# EAGLE design WarpverterSimulator_201904_01 (EAGLE 6.1)
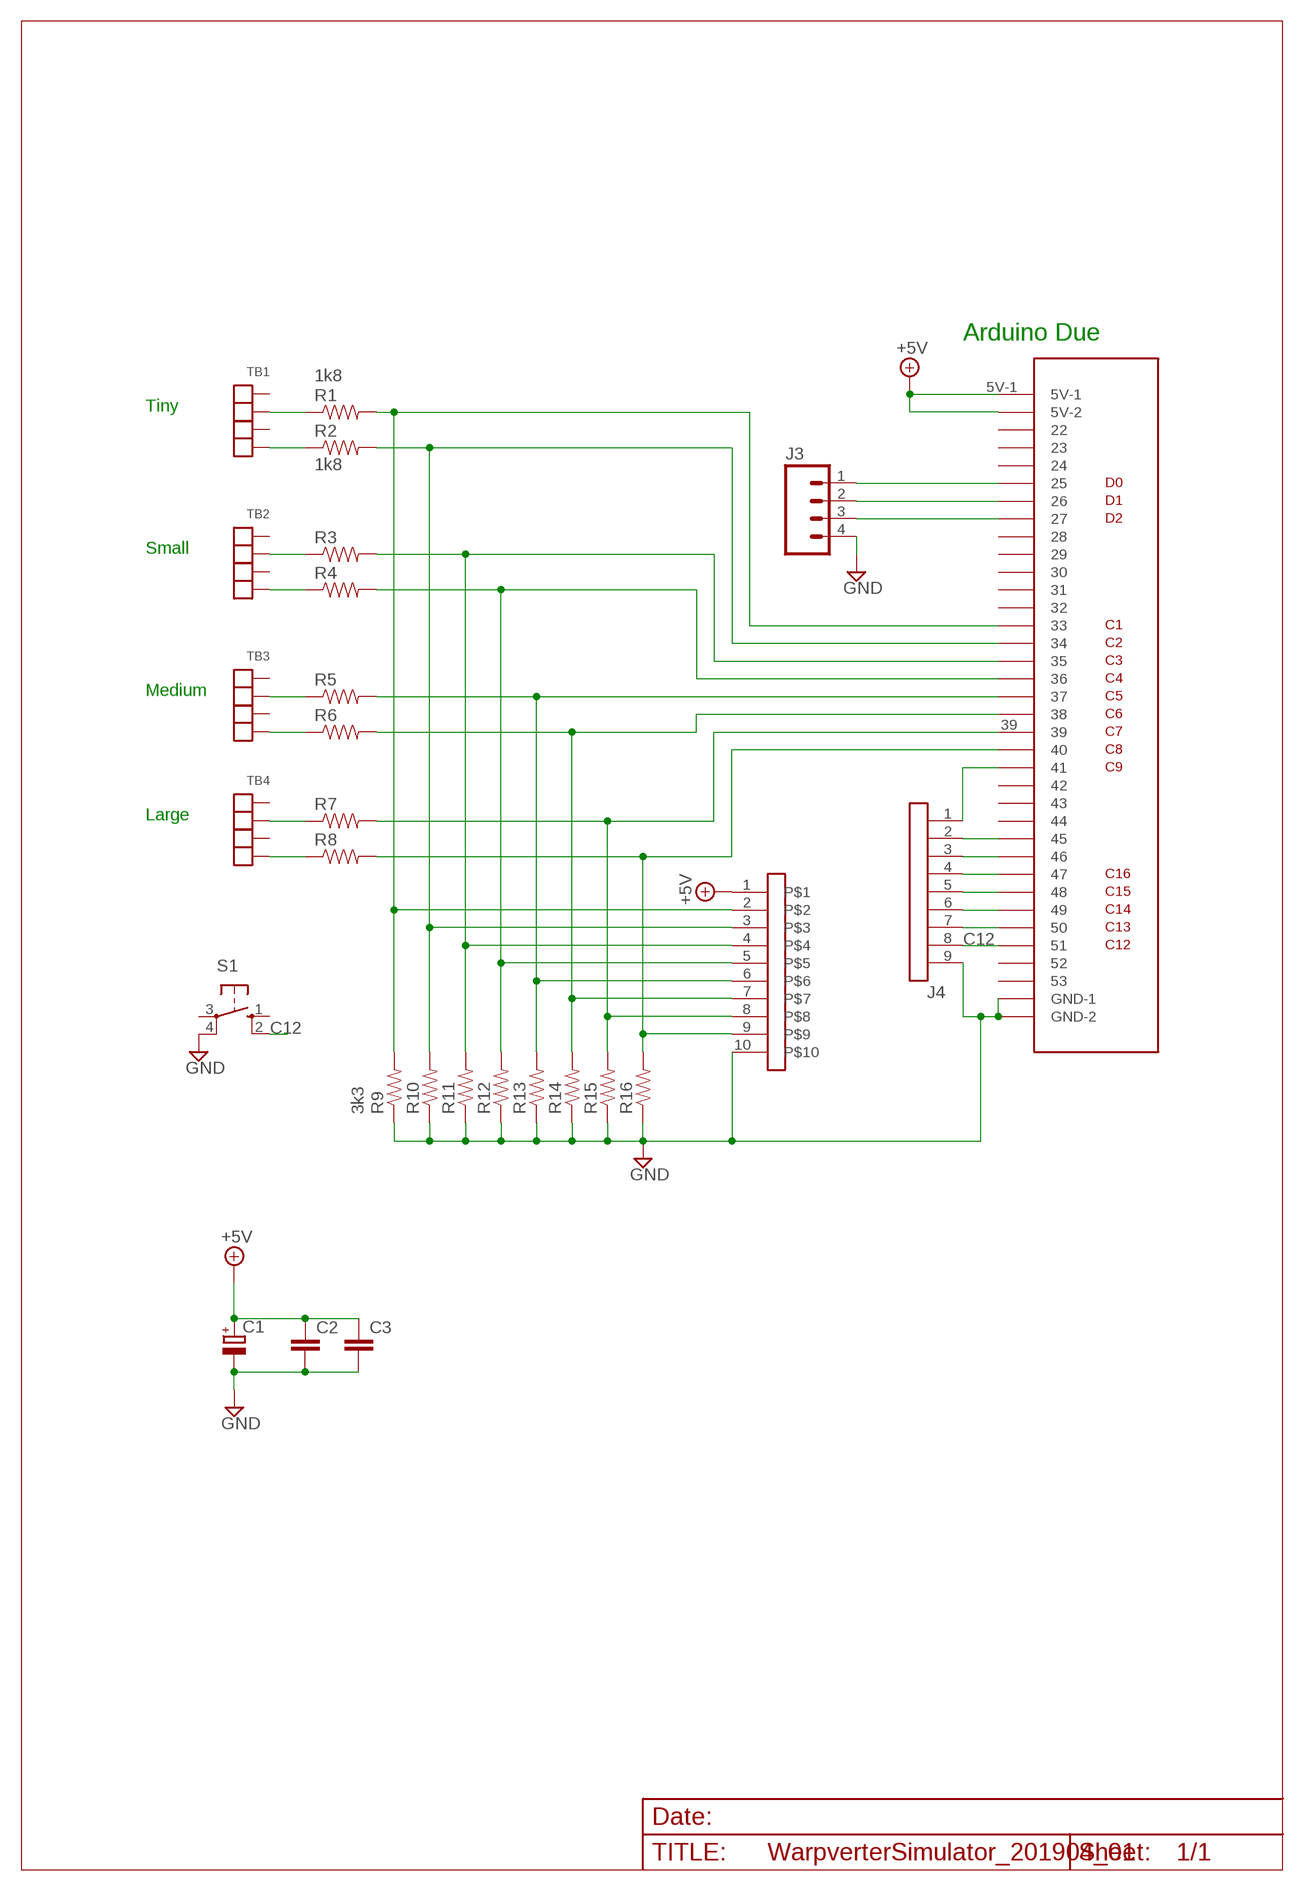
[diagram p0: schematic, sheet 1]

## Parts
C1  C-RB200100  [CPOL-RADIAL-10UF-25V]
C2  BCAP  [BCAP]
C3  BCAP  [BCAP]
J1  DUE-IDC38  [DUE-IDC38]
J2  SIL-STACK-10  [SIL-STACK-10]
J3  SIL4  [SIL4]
J4  SIL-9  [SIL-9]
R1  1k8  R4  [AXIAL-0.4]
R2  1k8  R4  [AXIAL-0.4]
R3  R4  [AXIAL-0.4]
R4  R4  [AXIAL-0.4]
R5  R4  [AXIAL-0.4]
R6  R4  [AXIAL-0.4]
R7  R4  [AXIAL-0.4]
R8  R4  [AXIAL-0.4]
R9  3k3  R4  [AXIAL-0.4]
R10  R4  [AXIAL-0.4]
R11  R4  [AXIAL-0.4]
R12  R4  [AXIAL-0.4]
R13  R4  [AXIAL-0.4]
R14  R4  [AXIAL-0.4]
R15  R4  [AXIAL-0.4]
R16  R4  [AXIAL-0.4]
S1  10-XX  [B3F-10XX]
TB1  TB4381_SIL  [TB-381-SIL-4P]
TB2  TB4381_SIL  [TB-381-SIL-4P]
TB3  TB4381_SIL  [TB-381-SIL-4P]
TB4  TB4381_SIL  [TB-381-SIL-4P]

## Nets
+5V: C1.1(+) C2.1 C3.1 J1.5V-1 J1.5V-2 J2.1
C12: J1.51 J4.8 S1.2(S1)
GND: C1.2(-) C2.2 C3.2 J1.GND-1 J1.GND-2 J2.10 J3.4 J4.9 R9.P$1 R10.P$1 R11.P$1 R12.P$1 R13.P$1 R14.P$1 R15.P$1 R16.P$1 S1.4(P1)
N$1: R1.P$1 TB1.2 TB1.12
N$2: R2.P$1 TB1.4 TB1.14
N$3: R3.P$1 TB2.2 TB2.12
N$4: R4.P$1 TB2.4 TB2.14
N$5: R5.P$1 TB3.2 TB3.12
N$6: R6.P$1 TB3.4 TB3.14
N$7: R7.P$1 TB4.2 TB4.12
N$8: R8.P$1 TB4.4 TB4.14
N$9: J1.33 J2.2 R1.P$2 R9.P$2
N$10: J1.34 J2.3 R2.P$2 R10.P$2
N$11: J1.35 J2.4 R3.P$2 R11.P$2
N$12: J1.36 J2.5 R4.P$2 R12.P$2
N$13: J1.37 J2.6 R5.P$2 R13.P$2
N$14: J1.38 J2.7 R6.P$2 R14.P$2
N$15: J1.39 J2.8 R7.P$2 R15.P$2
N$16: J1.40 J2.9 R8.P$2 R16.P$2
N$18: J1.25 J3.1
N$19: J1.26 J3.2
N$20: J1.27 J3.3
N$24: J1.50 J4.7
N$25: J1.49 J4.6
N$26: J1.48 J4.5
N$27: J1.47 J4.4
N$28: J1.46 J4.3
N$29: J1.45 J4.2
N$30: J1.41 J4.1
Unconnected: J1.22 J1.23 J1.24 J1.28 J1.29 J1.30 J1.31 J1.32 J1.42 J1.43 J1.44 J1.52 J1.53 S1.1(S) S1.3(P) TB1.1 TB1.3 TB1.11 TB1.13 TB2.1 TB2.3 TB2.11 TB2.13 TB3.1 TB3.3 TB3.11 TB3.13 TB4.1 TB4.3 TB4.11 TB4.13

## Notes on the sheet
- Arduino Due
- Tiny
- Small
- Medium
- Large

## Library data of the parts
C1 = Andrew:C-RB200100
C2 C3 = Andrew Misc:BCAP
J1 = Andrew_Arduino:DUE-IDC38
J2 = Andrew_Connectors:SIL-STACK-10
J3 = Andrew_Connectors:SIL4
J4 = Andrew_Connectors:SIL-9
R1-R16 = Andrew Misc:R4
S1 = switch-omron:10-XX: OMRON SWITCH; MPN: B3F-1000; OC_FARNELL: 176432; OC_NEWARK: 36M3542
TB1-TB4 = Andrew_Connectors:TB4

## Board
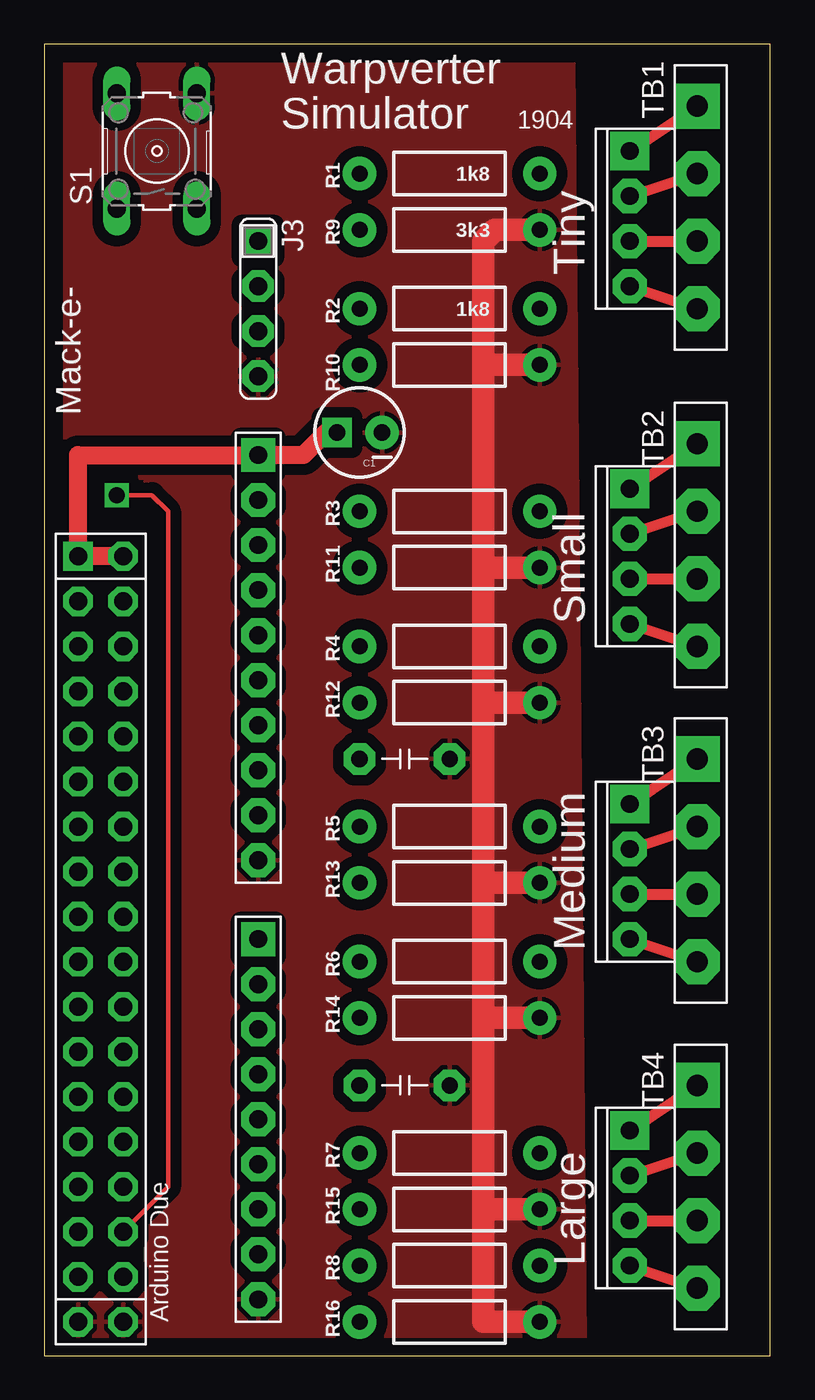
[diagram p1: board, top side]
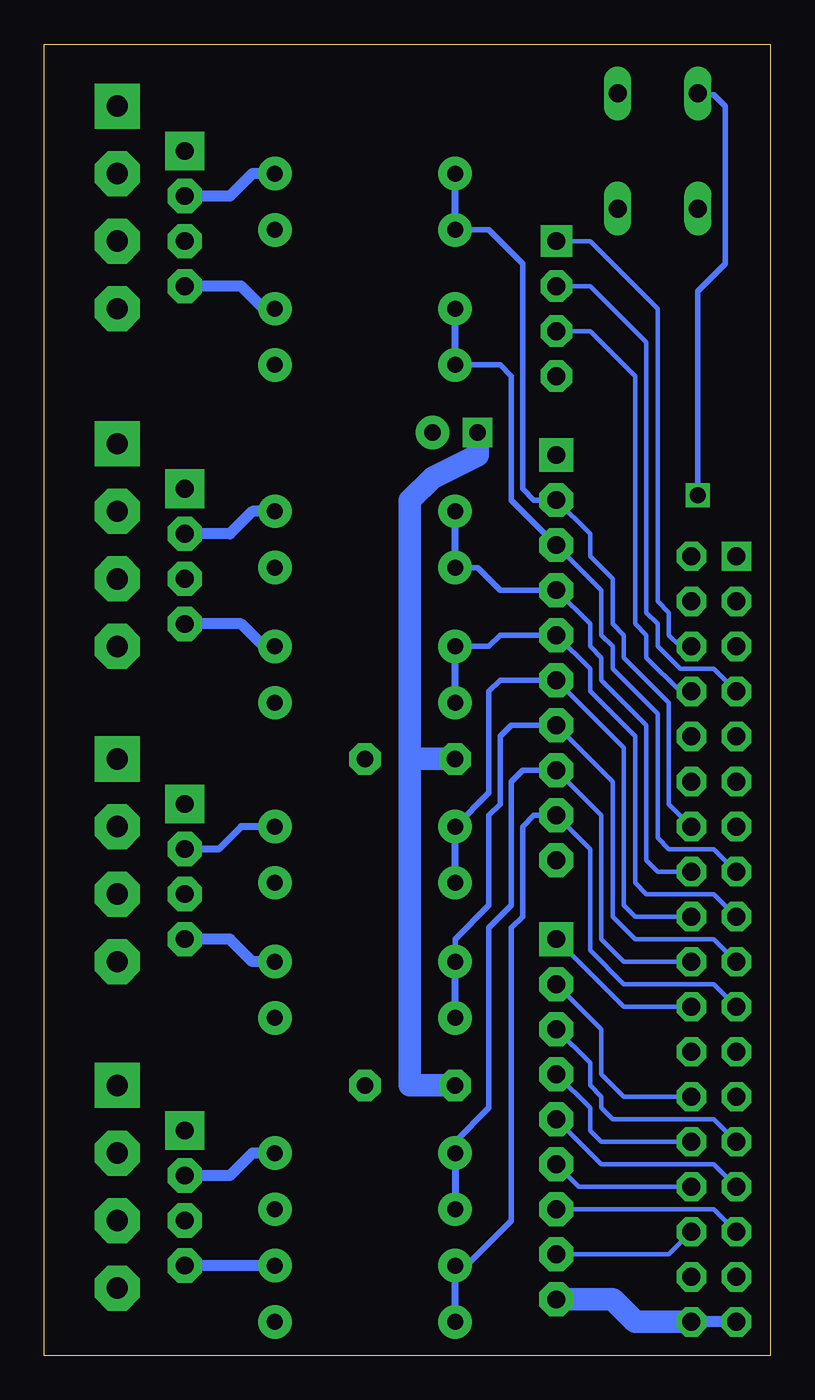
[diagram p2: board, bottom side, seen from below]

Size 40.95 x 73.97 mm. Coordinates in mm from the lower left corner, seen from the top.
Outline: 0,0 40.95,0 40.95,73.97 0,73.97 0,0
Copper layers (1*16): Top 0.035mm / dielectric 1.5mm / Bottom 0.035mm
Design rules: minimum track width 10mil, minimum drill 24mil, track to track 8mil, track to pad 8mil, pad to pad 8mil, via to via 8mil, smd to smd 8mil, copper to edge 40mil, drill to drill 8mil, minimum pad ring 10mil, minimum via ring 8mil, stop-mask expansion 4mil, vias tented up to drill 0mil, thermal gap 10mil

### Footprints (pad centres in the part's own frame; a part is rotated, then mirrored left to right if it is on the bottom)
CPOL-RADIAL-10UF-25V = drill 0.914 pad 1.651 square: 1 1.27,0 | drill 0.914 pad 1.905: 2 -1.27,0
BCAP = drill 0.914 pad 1.778 octagon: 1 -2.54,0; 2 2.54,0
DUE-IDC38 = drill 1.016 pad 1.651 square: 5V-1 0,2.54 | drill 1.016 pad 1.651 octagon: 5V-2 2.54,2.54; 22 0,0; 23 2.54,0; 24 0,-2.54; 25 2.54,-2.54; 26 0,-5.08; 27 2.54,-5.08; 28 0,-7.62; 29 2.54,-7.62; 30 0,-10.16; 31 2.54,-10.16; 32 0,-12.7; 33 2.54,-12.7; 34 0,-15.24; 35 2.54,-15.24; 36 0,-17.78; 37 2.54,-17.78; 38 0,-20.32; 39 2.54,-20.32; 40 0,-22.86; 41 2.54,-22.86; 42 0,-25.4; 43 2.54,-25.4; 44 0,-27.94; 45 2.54,-27.94; 46 0,-30.48; 47 2.54,-30.48; 48 0,-33.02; 49 2.54,-33.02; 50 0,-35.56; 51 2.54,-35.56; 52 0,-38.1; 53 2.54,-38.1; GND-1 0,-40.64; GND-2 2.54,-40.64
SIL-STACK-10 = drill 1 pad 1.905 square: 1 -11.43,0 | drill 1 pad 1.905 octagon: 2 -8.89,0; 3 -6.35,0; 4 -3.81,0; 5 -1.27,0; 6 1.27,0; 7 3.81,0; 8 6.35,0; 9 8.89,0; 10 11.43,0
SIL4 = drill 1 pad 1.778 square: 1 0,0 | drill 1 pad 1.778 octagon: 2 2.54,0; 3 5.08,0; 4 7.62,0
SIL-9 = drill 1 pad 1.905 square: 1 -11.43,0 | drill 1 pad 1.905 octagon: 2 -8.89,0; 3 -6.35,0; 4 -3.81,0; 5 -1.27,0; 6 1.27,0; 7 3.81,0; 8 6.35,0; 9 8.89,0
AXIAL-0.4 = drill 0.9 pad 1.88: P$1 -5.08,0; P$2 5.08,0
B3F-10XX = drill 1.016 long: 1 -3.251,2.261; 2 3.251,2.261; 3 -3.251,-2.261; 4 3.251,-2.261
TB-381-SIL-4P = drill 1.2 pad 2.54 square: 1 0,0 | drill 1.2 pad 2.54 octagon: 2 3.81,0; 3 7.62,0; 4 11.43,0 | drill 1 pad 2.184 square: 11 2.54,-3.81 | drill 1 pad 1.93 octagon: 12 5.08,-3.81; 13 7.62,-3.81; 14 10.16,-3.81

### Placement (x,y rotation side)
C1  17.78,52.07 180 top
C2  20.32,33.66 0 top
C3  20.32,15.24 0 top
J1  1.91,42.55 0 top
J2  12.06,39.37 270 top
J3  12.06,62.87 270 top
J4  12.06,12.06 270 top
R1  22.86,66.67 180 top
R2  22.86,59.05 180 top
R3  22.86,47.62 180 top
R4  22.86,40.01 180 top
R5  22.86,29.84 180 top
R6  22.86,22.23 180 top
R7  22.86,11.43 180 top
R8  22.86,5.08 180 top
R9  22.86,63.5 180 top
R10  22.86,55.88 180 top
R11  22.86,44.45 180 top
R12  22.86,36.83 180 top
R13  22.86,26.67 180 top
R14  22.86,19.05 180 top
R15  22.86,8.26 180 top
R16  22.86,1.91 180 top
S1  6.35,67.94 90 top
TB1  36.83,70.48 270 top
TB2  36.83,51.44 270 top
TB3  36.83,33.66 270 top
TB4  36.83,15.24 270 top

### Tracks (layer width: path | path; a pad name or v marks a point on that pad's centre or on a via)
+5V
  Top 1.016: J1.5V-2 J1.5V-1 1.91,50.8 J2.1 14.61,50.8 15.88,52.07 C1.1
  Bottom 1.27: C3.1 20.32,15.24 20.32,33.66 | 20.32,33.66 20.32,48.26 19.05,49.53 16.51,50.8 C1.1 | C2.1 20.32,33.66
C12  (via drill 0.9)
  Top 0.254: v4.09,48.54 6.07,48.54 6.99,47.62 6.99,9.53 J1.51
  Bottom 0.254: J1.51 5.71,5.71 J4.8
  Bottom 0.305: v4.09,48.54 4.09,60.05 2.54,61.59 2.54,70.48 3.17,71.12 4.17,71.12 | 4.45,71.12 4.17,71.12 | 4.17,71.12 S1.2
GND
  Top 1.27: R9.P$1 25.4,63.5 24.77,62.87 24.77,55.88 | 24.77,55.88 24.77,44.45 | 24.77,44.45 24.77,36.83 | 24.77,36.83 24.77,26.67 | 24.77,26.67 24.77,19.05 | 24.77,19.05 24.77,8.26 | 24.77,8.26 24.77,1.91 R16.P$1 | R15.P$1 24.77,8.26 | R14.P$1 24.77,19.05 | R13.P$1 24.77,26.67 | R12.P$1 24.77,36.83 | R11.P$1 24.77,44.45 | R10.P$1 24.77,55.88
  Bottom 0.61: J1.GND-1 J1.GND-2
  Bottom 1.27: J1.GND-2 7.62,1.91 8.89,3.17 J4.9
  pour Top (isolate 0.61): 0.64,73.03 0.64,49.53 5.71,49.53 5.71,4.45 0.64,4.45 0.64,0.64 30.48,0.64 29.84,73.03
N$1
  Bottom 0.61: R1.P$1 29.21,66.67 30.48,65.41 TB1.12
N$2
  Bottom 0.61: R2.P$1 28.57,59.05 29.84,60.33 TB1.14
N$3
  Bottom 0.61: R3.P$1 29.21,47.62 30.48,46.35 TB2.12
N$4
  Bottom 0.61: R4.P$1 28.57,40.01 29.84,41.27 TB2.14
N$5
  Bottom 0.406: R5.P$1 29.84,29.84 31.11,28.57 TB3.12
N$6
  Bottom 0.61: R6.P$1 29.21,22.23 30.48,23.5 TB3.14
N$7
  Bottom 0.61: R7.P$1 29.21,11.43 30.48,10.16 TB4.12
N$8
  Bottom 0.61: R8.P$1 TB4.14
N$9
  Bottom 0.254: J1.33 5.71,31.11 5.71,36.83 8.26,39.37 8.26,40.64 8.89,41.27 8.89,43.81 10.16,45.09 10.16,46.35 J2.2
  Bottom 0.305: J2.2 13.34,48.26 13.97,48.9 13.97,61.59 15.88,63.5 R9.P$2
  Bottom 0.406: R9.P$2 R1.P$2
N$10
  Bottom 0.254: J1.34 3.17,28.57 5.71,28.57 6.35,29.21 6.35,36.2 8.89,38.73 8.89,40.01 9.53,40.64 9.53,43.18 J2.3
  Bottom 0.305: J2.3 14.61,48.26 14.61,55.24 15.24,55.88 R10.P$2
  Bottom 0.406: R10.P$2 R2.P$2
N$11
  Bottom 0.254: J1.35 6.35,27.3 6.99,27.94 6.99,35.56 9.53,38.1 9.53,39.37 10.16,40.01 10.16,41.27 J2.4
  Bottom 0.305: J2.4 15.24,43.18 16.51,44.45 R11.P$2
  Bottom 0.406: R11.P$2 R3.P$2
N$12
  Bottom 0.254: J1.36 3.17,26.04 6.99,26.04 7.62,26.67 7.62,34.92 10.16,37.47 10.16,38.73 J2.5
  Bottom 0.305: J2.5 15.24,40.64 15.88,40.01 R4.P$2
  Bottom 0.406: R12.P$2 R4.P$2
N$13
  Bottom 0.254: J1.37 7.62,24.77 8.26,25.4 8.26,34.29 J2.6
  Bottom 0.305: R5.P$2 15.88,31.75 15.88,37.47 15.24,38.1 J2.6
  Bottom 0.406: R13.P$2 R5.P$2
N$14
  Bottom 0.254: J1.38 3.17,23.5 7.62,23.5 8.89,24.77 8.89,32.38 J2.7
  Bottom 0.305: R6.P$2 17.78,23.5 15.88,25.4 15.88,30.48 15.24,31.11 15.24,34.92 14.61,35.56 J2.7
  Bottom 0.406: R14.P$2 R6.P$2
N$15
  Bottom 0.254: J1.39 8.26,22.23 9.53,23.5 9.53,30.48 J2.8
  Bottom 0.305: R7.P$2 17.78,12.06 15.88,13.97 15.88,24.13 14.61,25.4 14.61,32.38 13.97,33.02 J2.8
  Bottom 0.406: R7.P$2 R15.P$2
N$16
  Bottom 0.254: J1.40 3.17,20.95 8.26,20.95 10.16,22.86 10.16,28.57 J2.9
  Bottom 0.305: R8.P$2 17.14,5.08 14.61,7.62 14.61,24.13 13.97,24.77 13.97,29.84 13.34,30.48 J2.9
  Bottom 0.406: R16.P$2 R8.P$2
N$18
  Bottom 0.254: J1.25 5.08,40.01 5.71,40.64 5.71,41.91 6.35,42.55 6.35,59.05 10.16,62.87 J3.1
N$19
  Bottom 0.254: J1.26 3.17,38.73 5.08,38.73 6.35,40.01 6.35,41.27 6.99,41.91 6.99,57.15 10.16,60.33 J3.2
N$20
  Bottom 0.254: J1.27 5.08,37.47 6.99,39.37 6.99,40.64 7.62,41.27 7.62,55.24 10.16,57.78 J3.3
N$24
  Bottom 0.254: J1.50 3.17,8.26 J4.7
N$25
  Bottom 0.254: J1.49 10.79,9.53 J4.6
N$26
  Bottom 0.254: J1.48 3.17,10.79 9.53,10.79 J4.5
N$27
  Bottom 0.254: J1.47 9.53,12.06 10.16,12.7 10.16,13.97 J4.4
N$28
  Bottom 0.254: J1.46 3.17,13.34 8.89,13.34 9.53,13.97 9.53,14.61 10.16,15.24 10.16,16.51 J4.3
N$29
  Bottom 0.254: J1.45 8.26,14.61 9.53,15.88 9.53,18.41 J4.2
N$30
  Bottom 0.254: J1.41 8.26,19.68 J4.1

### Text on the board
tPlace: Warpverter | Simulator | 1904 | Tiny | Mack-e- | Small | Medium | Large | Arduino Due